# EasyEDA Pro project battery.eprj

# Schematic Schematic1
Board Name: Board1; Create Date: 2025-09-05; Page Name: P1; Project Name: battery; Schematic Name: Schematic1; Update Date: 2025-09-05; Company: 嘉立创EDA; Page Size: A4; Version: V1.0
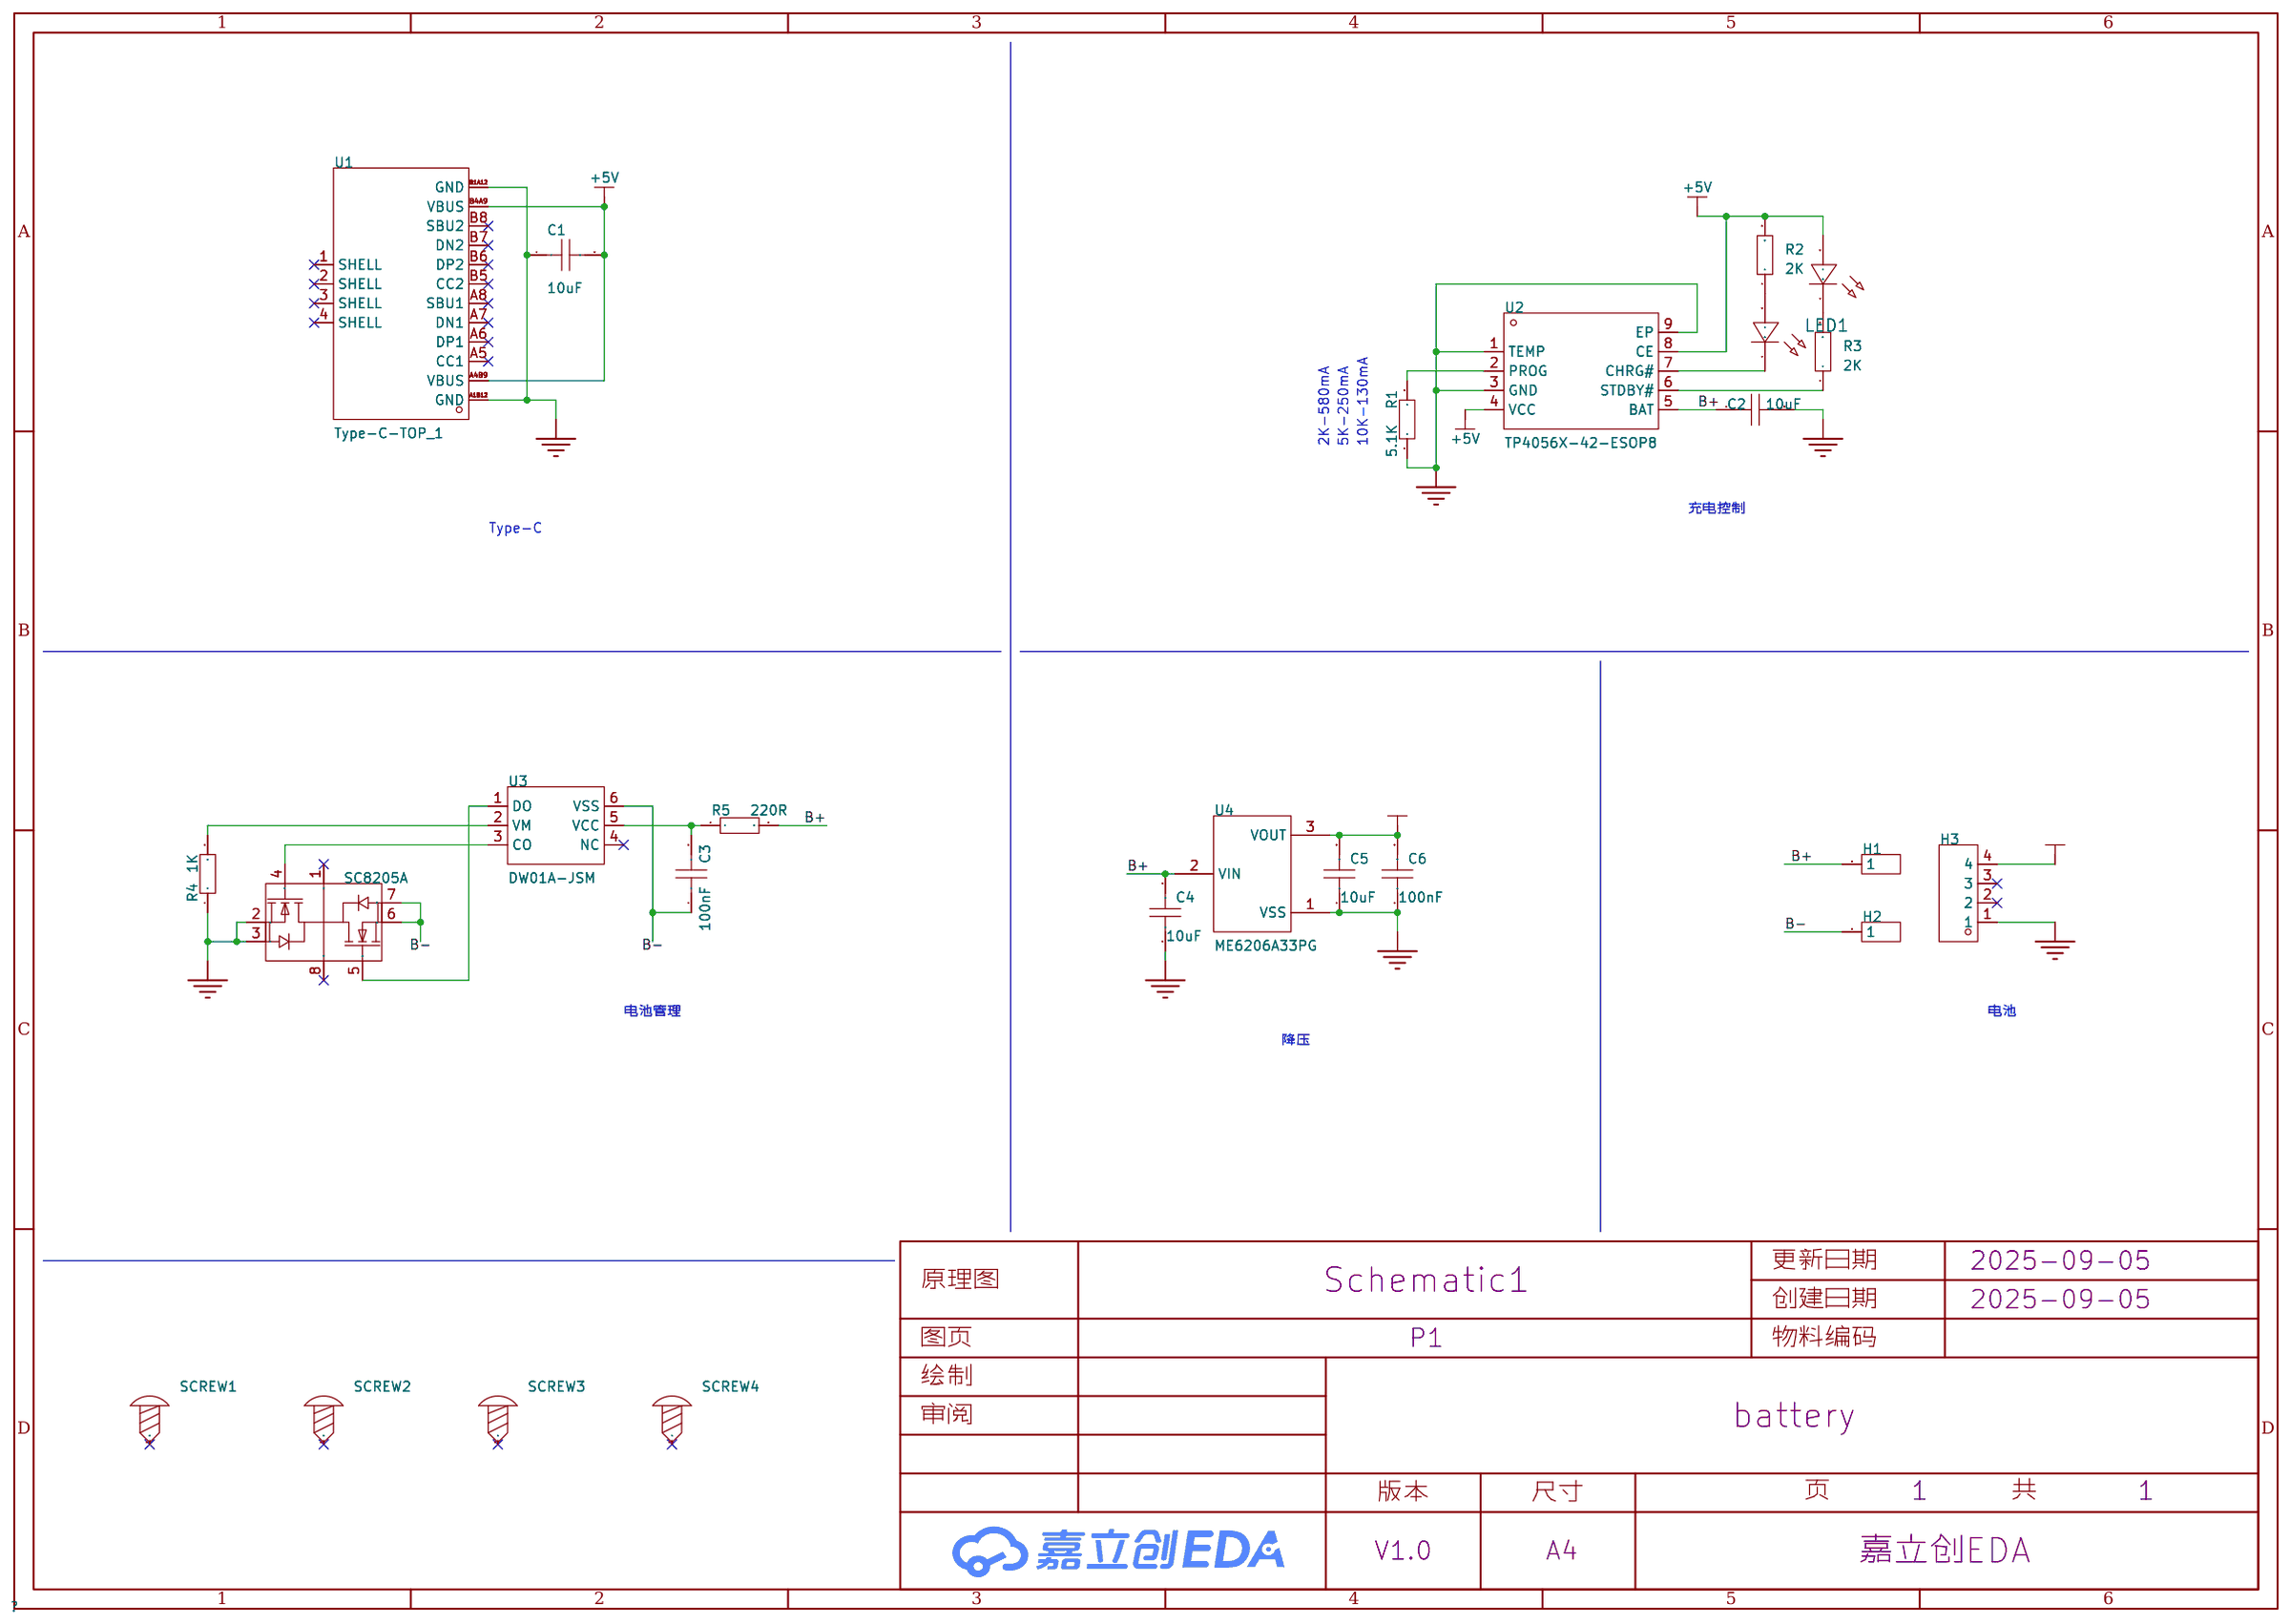
[diagram p0: schematic sheet]

## Parts
C1  10uF  [C0805]
C2  10uF  [C0805]
C3  100nF  [C0805]
C4  10uF  [C0805]
C5  10uF  [C0805]
C6  100nF  [C0805]
H1  -  [HDR-TH_1P-V-M_XKB_X4611WV-01I-C28D40]
H2  -  [HDR-TH_1P-V-M_XKB_X4611WV-01I-C28D40]
H3  -  [HDR-TH_4P-P2.54-V-M]
LED1  -  [LED_0805]
LED2  -  [LED_0805]
Q1  SC8205A  [TSSOP-8_L4.4-W3.0-P0.65-LS6.4-BL]
R1  5.1K  [R0805]
R2  2K  [R0805]
R3  2K  [R0805]
R4  1K  [R0805]
R5  220R  [R0805]
SCREW1  -  [M3螺丝]
SCREW2  -  [M3螺丝]
SCREW3  -  [M3螺丝]
SCREW4  -  [M3螺丝]
U1  Type-C-TOP_1  [USB-C-SMD_TYPE-C16PIN]
U2  TP4056X-42-ESOP8  [SOP-8_L4.9-W3.9-P1.27-LS6.0-TL-EP]
U3  DW01A-JSM  [SOT-23-6_L2.9-W1.6-P0.95-LS2.8-BR]
U4  ME6206A33PG  [SOT-89-3_L4.5-W2.5-P1.50-LS4.2-BR]

## Library data of the parts
C1-C6 = CAP_0805: Supplier Footprint: 0805
H1 H2 = HDR-M_2.54_1x1P: Supplier Part: C81276; Supplier Footprint: 插件; JLCPCB Part Class: Extended Part
H3 = HDR-M_2.54_1x4P: Supplier Part: C492403; Supplier Footprint: 插件
LED1 = LED_0805-R: Supplier Footprint: 0805
LED2 = LED_0805-G: Supplier Footprint: 0805
Q1 = SC8205A: LCSC Part Name: 2个N沟道 耐压:20V 电流:6A; Supplier Part: C83931; Manufacturer: FM(富满); Supplier Footprint: TSSOP-8; JLCPCB Part Class: 扩展库; Datasheet: https://item.szlcsc.com/datasheet/SC8205A/85099.html; Supplier: LCSC; Number: 2个N沟道; Drain to Source Voltage: 20V; RDS(on): 25mΩ@10V,5A; Pd - Power Dissipation: 2W; Gate Threshold Voltage (Vgs(th)): 1.5V
R1-R5 = Res_0805: Supplier Footprint: 0805
SCREW1-SCREW4 = M3螺丝: Supplier Footprint: 插件
U1 = Type-C-TOP_1: Supplier Part: C9900005857; Supplier Footprint: Type-C16P; JLCPCB Part Class: 扩展库; Supplier: LCSC
U2 = TP4056X-42-ESOP8: Supplier Part: C2763448; Manufacturer: TOPPOWER(南京拓微); Supplier Footprint: SOP-8-EP; JLCPCB Part Class: 扩展库; Datasheet: https://item.szlcsc.com/datasheet/TP4056X-42-ESOP8/2893069.html; Supplier: LCSC; The Chip Type: 线性充电芯片; Voltage - Supply: 4V~8V; Charge Current - Max: 1A; Charging Saturation Voltage: 4.2V; Type of Battery: 锂离子/聚合物; Number of Cells: 1; Operating Temperature: -40℃~+85℃; Battery Temperature Detection: 支持; Supply Current (Iq): 70uA
U3 = DW01A-JSM: LCSC Part Name: 单节锂电池保护IC; Supplier Part: C39846919; Manufacturer: JSMSEMI(杰盛微); Supplier Footprint: SOT-23-6; Datasheet: https://item.szlcsc.com/datasheet/DW01A-JSM/41578852.html; Supplier: LCSC; The Chip Type: 电池保护芯片; Voltage - Supply: 300mV~6V
U4 = ME6206A33PG: LCSC Part Name: 输入6V 输出3.3V 300mA; Supplier Part: C79022; Manufacturer: MICRONE(南京微盟); Supplier Footprint: SOT-89-3; JLCPCB Part Class: 扩展库; Datasheet: https://item.szlcsc.com/datasheet/ME6206A33PG/80159.html; Supplier: LCSC; Output Type: 固定; Voltage - Supply: 6V; Output Voltage: 3.3V; Output Current: 300mA; Power Supply Rejection Ratio (PSRR): 50dB@(1kHz); Voltage Dropout: 180mV@(80mA)；380mV@(200mA); standby current: 9uA; Features: 过流保护; Operating Temperature: -25℃~+85℃; Output Configuration: 正极; Number of Outputs: 1

## Nets
+3.3V: C5.2 C6.2 H3.4 U4.3(VOUT)
+5V: C1.2 LED2.2(A) R2.2 U1.A4B9(VBUS) U1.B4A9(VBUS) U2.4(VCC) U2.8(CE)
GND: C1.1 C2.2 C4.1 C5.1 C6.1 H3.1 Q1.2(S1) Q1.3(S1) R1.1 R4.1 U1.A1B12(GND) U1.B1A12(GND) U2.1(TEMP) U2.3(GND) U2.9(EP) U4.1(VSS)
B+: C2.1 C4.2 H1.1 R5.2 U2.5(BAT) U4.2(VIN)
B-: C3.1 H2.1 Q1.6(S2) Q1.7(S2) U3.6(VSS)
$1N875: LED1.1(C) U2.7(CHRG#)
$1N926: R3.1 U2.6(STDBY#)
$1N952: LED1.2(A) R2.1
$1N1277: R1.2 U2.2(PROG)
$1N1775: C3.2 R5.1 U3.5(VCC)
$1N1913: R4.2 U3.2(VM)
$1N2035: Q1.4(G1) U3.3(CO)
$1N2040: Q1.5(G2) U3.1(DO)
$1N2206: LED2.1(C) R3.2

Not connected (* = marked no-connect by the designer): H3 2* 3*; Q1 1(D12)* 8(D12)*; SCREW1 1*; SCREW2 1*; SCREW3 1*; SCREW4 1*; U1 1(SHELL)* 2(SHELL)* 3(SHELL)* 4(SHELL)* A5(CC1)* A6(DP1)* A7(DN1)* A8(SBU1)* B5(CC2)* B6(DP2)* B7(DN2)* B8(SBU2)*; U3 4(NC)*

## Notes on the sheet
- 2K-580mA
- 5K-250mA
- 10K-130mA
- 充电控制
- Type-C
- 电池管理
- 电池
- 降压

# Board PCB1
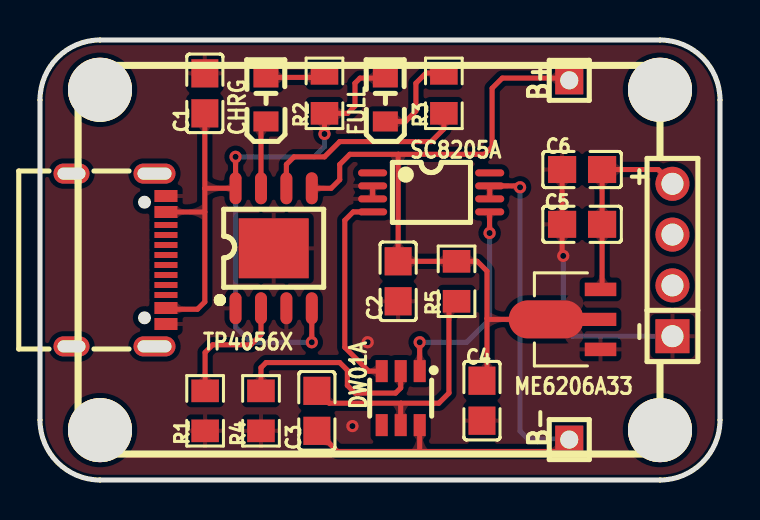
[diagram p1: board, top side]
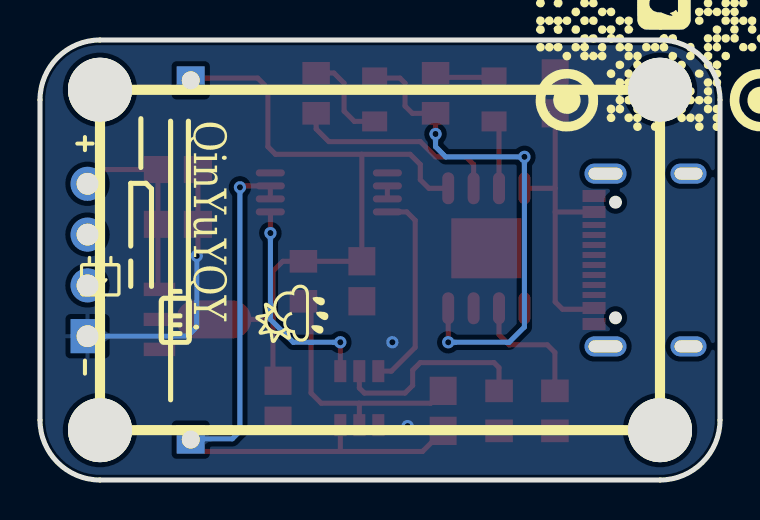
[diagram p2: board, bottom side, seen from below]

Outline 34 x 22 mm; copper layers: Top Layer, Bottom Layer. Coordinates in mm from the lower left corner of the outline.
Outline path: 0,19 0,3 arc(0.88,0.88) 3,0 31,0 arc(33.12,0.88) 34,3 34,19 arc(33.12,21.12) 31,22 3,22 arc(0.88,21.12) 0,19
Stack: Top Layer 0.035mm / Dielectric1 1.51mm FR4 er 4.5 / Bottom Layer 0.035mm

## Design rules (mm)
template: JLCPCB Capability(Two Layers Board)
spacing copperThickness1oz (default): track to track 0.102, other pairs 0.152 to 0.3
spacing copperThickness2oz: track to track 0.203, other pairs 0.152 to 0.3
track width copperThickness1oz (default): min 0.127, default 0.254, max 2.54
track width copperThickness2oz: min 0.203, default 0.254, max 2.54
differential pair differentialPair (default): width min 0.127, default 0.254, max 2.54; gap min 0.152, default 0.152
via viaSize (default): diameter min 0.5, default 0.61, max 10; hole min 0.3, default 0.305, max 6.3

## Placement (name value [footprint] x y rotation side)
C1  10uF  [C0805]  8.24 19.33 270 top
C2  10uF  [C0805]  17.91 9.94 270 top
C3  100nF  [C0805]  13.84 3.46 90 top
C4  10uF  [C0805]  22.1 3.97 90 top
C5  10uF  [C0805]  27.1 12.78 0 top
C6  100nF  [C0805]  27.1 15.52 0 top
H1  -  [HDR-TH_1P-V-M_XKB_X4611WV-01I-C28D40]  26.46 19.98 0 top
H2  -  [HDR-TH_1P-V-M_XKB_X4611WV-01I-C28D40]  26.46 2.02 0 top
H3  -  [HDR-TH_4P-P2.54-V-M]  31.62 11 90 top
LED1  -  [LED_0805]  11.3 19.08 90 top
LED2  -  [LED_0805]  17.27 19.08 90 top
Q1  SC8205A  [TSSOP-8_L4.4-W3.0-P0.65-LS6.4-BL]  19.56 14.38 270 top
R1  5.1K  [R0805]  8.25 3.46 90 top
R2  2K  [R0805]  14.22 19.33 270 top
R3  2K  [R0805]  20.19 19.33 90 top
R4  1K  [R0805]  11.05 3.46 90 top
R5  220R  [R0805]  20.83 9.94 90 top
SCREW1  -  [M3螺丝]  31 19.51 0 top
SCREW2  -  [M3螺丝]  3 19.51 0 top
SCREW3  -  [M3螺丝]  3 2.49 0 top
SCREW4  -  [M3螺丝]  31 2.49 0 top
U1  Type-C-TOP_1  [USB-C-SMD_TYPE-C16PIN]  3.94 11 270 top
U2  TP4056X-42-ESOP8  [SOP-8_L4.9-W3.9-P1.27-LS6.0-TL-EP]  11.68 11.59 90 top
U3  DW01A-JSM  [SOT-23-6_L2.9-W1.6-P0.95-LS2.8-BR]  18.03 4.09 90 top
U4  ME6206A33PG  [SOT-89-3_L4.5-W2.5-P1.50-LS4.2-BR]  26.67 8.03 0 top

## Footprints (pads in the part's own frame, mm; a bottom-side part is the same pattern mirrored in y, then rotated)
C0805
  rect 1.41x1.35 smd: 1(-1,0) 2(1,0)
HDR-TH_1P-V-M_XKB_X4611WV-01I-C28D40
  rect 1.4x1.4 hole 0.9: 1(0,0)
HDR-TH_4P-P2.54-V-M
  rect 1.7x1.7 hole 1.1: 1(-3.81,0)
  round 1.7 hole 1.1: 2(-1.27,0) 3(1.27,0) 4(3.81,0)
LED_0805
  rect 1x1.25 smd: 1(-1.15,0.005) 2(1.05,0.005)
M3螺丝
  round 3.2 hole 3.2: 1(0,0)
R0805
  rect 1.133x1.377 smd: 1(-1,0) 2(1,0)
SOP-8_L4.9-W3.9-P1.27-LS6.0-TL-EP
  oval 1.6x0.6 smd: 1(-3,1.905) 2(-3,0.635) 3(-3,-0.635) 4(-3,-1.905) 5(3,-1.905) 6(3,-0.635) 7(3,0.635) 8(3,1.905)
  rect 3x3.5 smd: 9(0,0)
SOT-23-6_L2.9-W1.6-P0.95-LS2.8-BR
  rect 1.1x0.6 smd: 1(1.35,-0.95) 2(1.35,0) 3(1.35,0.95) 4(-1.35,0.95) 5(-1.35,0) 6(-1.35,-0.95)
SOT-89-3_L4.5-W2.5-P1.50-LS4.2-BR
  rect 1.575x0.672 smd: 1(1.356,-1.5) 3(1.356,1.5)
  custom 5.377x1.9 smd: 2(-1.356,0)
TSSOP-8_L4.4-W3.0-P0.65-LS6.4-BL
  oval 0.353x1.454 smd: 1(-0.975,-2.927) 2(-0.325,-2.927) 3(0.325,-2.927) 4(0.975,-2.927) 5(0.975,2.927) 6(0.325,2.927) 7(-0.325,2.927) 8(-0.975,2.927)
USB-C-SMD_TYPE-C16PIN
  oval 1x2.1 hole 0.6x1.7: 1(-4.32,1.788) 2(4.32,1.788)
  oval 1x1.8 hole 0.6x1.4: 3(-4.32,-2.362) 4(4.32,-2.362)
  rect 0.6x1.15 smd: A1B12(-3.2,2.362) A4B9(-2.4,2.362) B1A12(3.2,2.362) B4A9(2.4,2.362)
  rect 0.3x1.15 smd: A5(-1.25,2.362) A6(-0.25,2.362) A7(0.25,2.362) A8(1.25,2.362) B5(1.75,2.362) B6(0.75,2.362) B7(-0.75,2.362) B8(-1.75,2.362)

## Nets
As in the schematic.

Pads without a net: H3 2 3; Q1 1 8; SCREW1 1; SCREW2 1; SCREW3 1; SCREW4 1; U1 1 2 3 4 A5 A6 A7 A8 B5 B6 B7 B8; U3 4

## Via types
v1: diameter 0.61, hole 0.305, Top Layer to Bottom Layer, 9 vias

## Routing (per net, layer and track width the routed paths; a pad name or vN(x,y) marks a point on that pad's centre or on a via; arc(x,y) is an arc through that point)
+3.3V: length 9.8
  Top Layer w0.254: H3.4 30.91,15.52 C6.2 C5.2 28.1,9.61 U4.3
+5V: length 41.7
  Top Layer w0.254: C1.2 8.24,14.58 ; 8.24,14.58 8.25,14.59 U2.8 v1(9.78,16.16) ; 8.24,14.58 8.24,8.91 7.87,8.54 6.36,8.54 U1.B4A9 ; U1.A4B9 8.24,13.4 ; LED2.2 17.23,20.09 16,20.09 15.75,19.84 15.75,18.7 15.38,18.33 R2.2 v1(14.22,17.3) ; v1(13.59,6.89) U2.4
  Bottom Layer w0.254: v1(13.59,6.89) 10.54,6.89 9.78,7.65 v1(9.78,16.16) 13.72,16.16 14.22,16.67 v1(14.22,17.3)
GND: length 14.2
  Top Layer w0.254: 16.63,14.06 Q1.2 ; C6.1 C5.1 26.1,11.26 v1(26.16,11.2)
  Bottom Layer w0.254: v1(26.16,11.2) 26.16,7.65 26.62,7.19 H3.1
  vias: v1(15.62,2.7) v1(16.38,6.89)
B+: length 35.9
  Top Layer w0.254: U2.5 14.56,14.59 14.99,15.02 14.99,15.78 15.49,16.28 17.91,16.28 ; 22.35,8.07 22.39,8.03 U4.2 ; 22.35,8.07 22.35,5.22 C4.2 ; 22.35,8.07 22.35,10.44 21.86,10.94 R5.2 C2.1 17.91,16.28 17.91,16.28 ; 17.91,16.28 22.22,16.28 22.61,16.67 22.61,19.59 23.11,20.09 26.37,20.09 26.46,20.19
B-: length 31.6
  Top Layer w0.254: v1(24,14.63) 23.93,14.7 Q1.7 22.49,14.06 ; 18.96,1.43 25.87,1.43 H2.1 ; 18.96,1.43 14.88,1.43 C3.1 ; 18.96,1.43 18.98,1.45 U3.6
  Bottom Layer w0.254: H2.1 26.42,2.06 24.38,2.06 24,2.44 v1(24,14.63)
$1N875: length 3.4
  Top Layer w0.254: U2.7 11.05,17.68 LED1.1
$1N926: length 10.6
  Top Layer w0.254: U2.6 12.32,15.78 12.7,16.16 14.22,16.16 14.99,16.92 19.56,16.92 20.19,17.56 R3.1
$1N952: length 3
  Top Layer w0.254: LED1.2 14.02,20.13 R2.1
$1N1277: length 6.4
  Top Layer w0.254: R1.2 8.25,6.38 8.64,6.76 10.54,6.76 11.05,7.27 U2.2
$1N1775: length 12.9
  Top Layer w0.254: R5.1 20.45,8.55 20.45,4.35 19.94,3.84 18.05,3.84 ; 18.05,3.84 18.03,3.83 U3.5 ; 18.05,3.84 14.46,3.84 C3.2
$1N1913: length 10.3
  Top Layer w0.254: R4.2 11.05,5.62 11.3,5.87 14.99,5.87 15.37,5.49 15.37,4.73 15.75,4.35 17.78,4.35 18.03,4.6 U3.2
$1N2035: length 10.3
  Top Layer w0.254: U3.3 16.43,5.44 15.24,6.63 15.24,12.98 15.66,13.41 Q1.4
$1N2040: length 10.8
  Top Layer w0.254: Q1.5 22.48,13.4 v1(22.48,12.35) ; U3.1 v1(18.98,6.89)
  Bottom Layer w0.254: v1(18.98,6.89) 21.34,6.89 22.48,8.03 v1(22.48,12.35)
$1N2206: length 4.8
  Top Layer w0.254: R3.2 20.18,20.35 19.3,20.35 18.8,19.84 18.8,18.44 18.28,17.93 LED2.1

## Copper pours and planes (outline as drawn; the poured copper is in the pictures)
GND on Top Layer: 0,22 34.04,22 34.04,0.03 0,0.03
GND on Bottom Layer: 0,22 34.04,22 34.04,0.03 0,0.03

Small or netless copper shapes (teardrops, artwork), in the pictures only: 66 on Top Layer, 10 on Bottom Layer

## Text on the board
Bottom Silkscreen Layer: + | - | QinYuYQY.
Top Silkscreen Layer: CHRG | FULL | TP4056X | SC8205A | ME6206A33 | DW01A | B+ | B- | + | -
